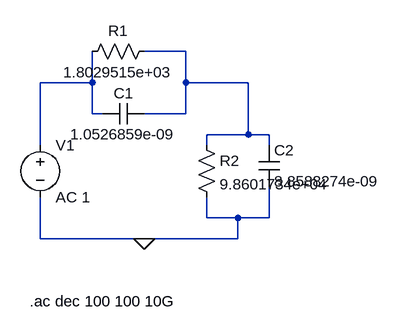
[diagram p0: schematic Double_RC.asc]
Double_RC.asc, the LTspice schematic file:
Version 4.1
SHEET 1 880 680
WIRE 336 -16 272 -16
WIRE 192 32 192 -16
WIRE 192 32 112 32
WIRE 336 32 336 -16
WIRE 432 32 336 32
WIRE 192 80 192 32
WIRE 208 80 192 80
WIRE 336 80 336 32
WIRE 336 80 272 80
WIRE 432 112 432 32
WIRE 432 112 368 112
WIRE 464 112 432 112
WIRE 112 128 112 32
WIRE 368 128 368 112
WIRE 464 128 464 112
WIRE 368 240 368 208
WIRE 416 240 368 240
WIRE 464 240 464 192
WIRE 464 240 416 240
WIRE 112 272 112 208
WIRE 272 272 112 272
WIRE 416 272 416 240
WIRE 416 272 272 272
FLAG 272 272 0
SYMBOL voltage 112 112 R0
SYMATTR InstName V1
SYMATTR Value AC 1
SYMBOL res 288 -32 R90
WINDOW 0 0 56 VBottom 2
WINDOW 3 32 56 VTop 2
SYMATTR InstName R1
SYMATTR Value 1.8029515e+03
SYMBOL cap 272 64 R90
WINDOW 0 0 32 VBottom 2
WINDOW 3 32 32 VTop 2
SYMATTR InstName C1
SYMATTR Value 1.0526859e-09
SYMBOL res 352 112 R0
SYMATTR InstName R2
SYMATTR Value 9.8601734e+04
SYMBOL cap 448 128 R0
SYMATTR InstName C2
SYMATTR Value 8.8588274e-09
TEXT 96 368 Left 2 !.ac dec 100 100 10G

The netlist it stands for:
* Double_RC.asc
V1 N002 0 AC 1
R1 N001 N002 1.8029515e+03
C1 N001 N002 1.0526859e-09
R2 N001 0 9.8601734e+04
C2 N001 0 8.8588274e-09
.ac dec 100 100 10G
.backanno
.end